# EasyEDA Pro project psu-5v-v101.eprj, board base-board
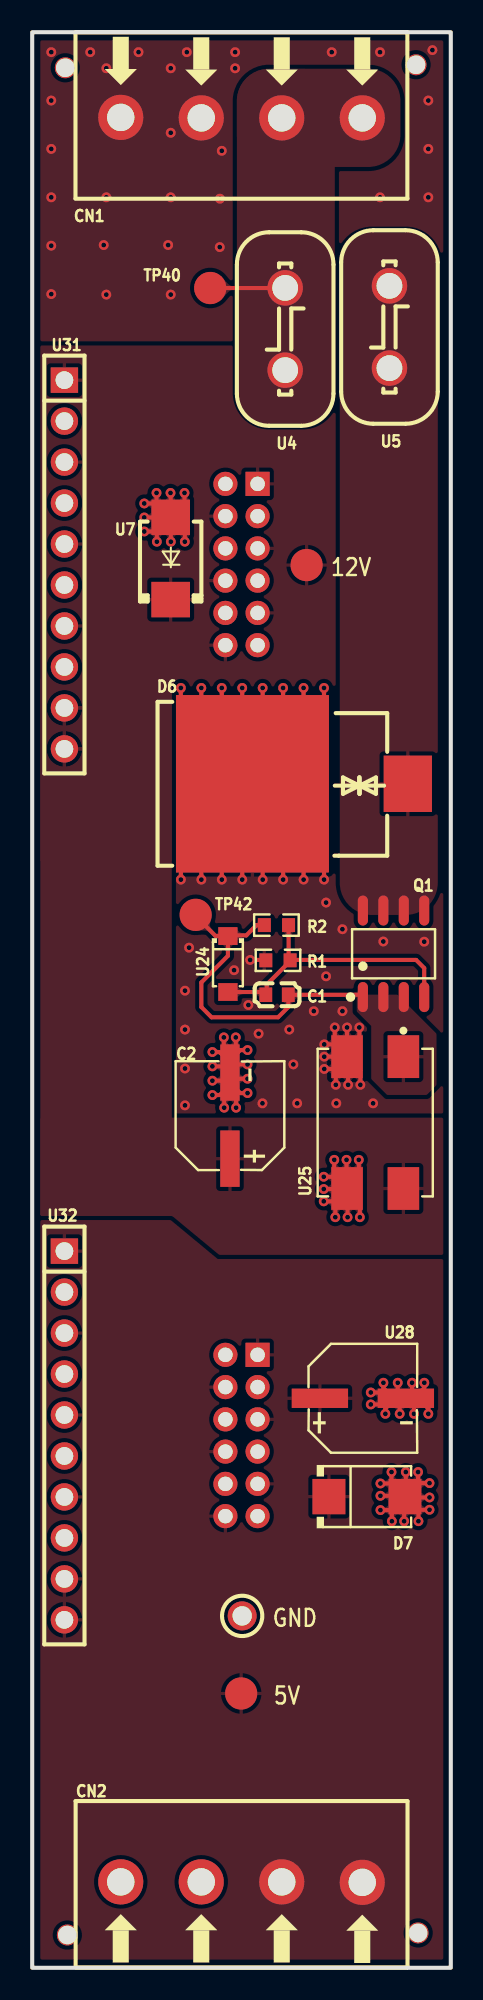
[diagram p5: board, top side]
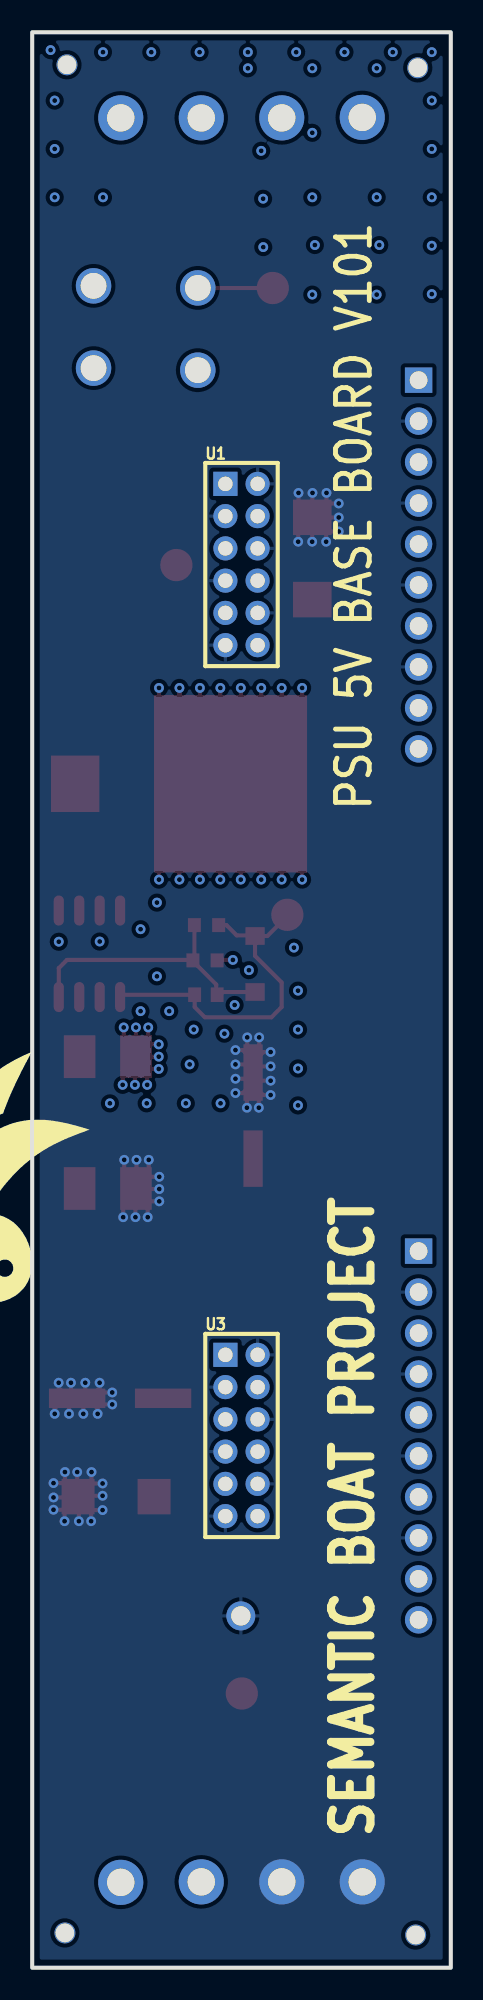
[diagram p6: board, bottom side, seen from below]

Outline 26 x 120 mm; copper layers: Top Layer, Inner1, Inner2, Bottom Layer. Coordinates in mm from the lower left corner of the outline.
Outline path: rectangle 0,120 26,0
Stack: Top Layer 0.07mm Outer layer thickness 1oz / Dielectric1 0.2104mm 7628 RC49% 8.6mil / Inner1 0.0152mm Inner layer thickness / Dielectric2 1.065mm 1.1mm H/HOZ Copper / Inner2 0.0152mm Inner layer thickness / Dielectric3 0.2104mm 7628 RC49% 8.6mil / Bottom Layer 0.07mm Outer layer thickness 1oz

## Design rules (mm)
template: Custom Config
spacing copperThickness1oz: track to track 0.102, other pairs 0.152 to 0.3
spacing copperThickness2oz (default): track to track 0.203, other pairs 0.152 to 0.3
spacing copperThicknessInner0.5oz: track to track 0.089, other pairs 0.152 to 0.3
track width copperThickness1oz: min 0.102, default 0.254, max 2.54
track width copperThickness2oz (default): min 0.203, default 0.254, max 2.54
track width copperThickness0.5oz: min 0.089, default 0.254, max 2.54
differential pair differentialPair (default): width min 0.127, default 0.254, max 2.54; gap min 0.152, default 0.152
via viaSize (default): diameter min 0.3, default 0.61, max 10; hole min 0.2, default 0.305, max 6.3

## Placement (name value [footprint] x y rotation side)
C1  100nF  [C0603]  15.21 60.33 180 top
C2  100uF  [CAP-SMD_BD6.3-L6.6-W6.6-LS7.6-RD]  12.28 52.83 90 top
CN1  WJ128V-5.0-4P  [CONN-TH_4P-P5.00_WJ128V-4P-5.0-14-00A]  13 114.71 180 top
CN2  WJ128V-5.0-4P  [CONN-TH_4P-P5.00_WJ128V-4P-5.0-14-00A]  13 5.31 0 top
D6  SM8S20CA  [DO-218AB_L13.5-W8.4-LS15.5-BI]  18.5 73.41 0 top
D7  SMBJ5.0A  [SMB_L4.6-W3.6-LS5.3-RD]  20.79 29.21 0 top
NOREF  -  [Pad_e17]  2.06 117.8 270 top
NOREF#2  -  [Pad_e14]  2.18 2.03 0 top
NOREF#3  -  [Pad_e16]  23.97 2.16 90 top
NOREF#4  -  [Pad_e19]  23.84 117.98 180 top
Q1  IRF7240TRPBF-JSM  [SOIC-8_L4.9-W4.0-P1.27-LS6.0-BL]  22.44 62.86 0 top
R1  47kΩ  [R0603]  15.27 62.46 0 top
R2  100kΩ  [R0603]  15.17 64.64 180 top
TP8  RH-5004  [TESTPOINT_TH_BD2.5-D1.2]  13.04 21.81 0 top
TP38  -  [Test-Point-0.5mm]  17.04 86.97 0 top
TP39  -  [Test-Point-0.5mm]  12.98 17 0 top
TP40  -  [Test-Point-0.5mm]  11.06 104.14 0 top
TP42  -  [Test-Point-0.5mm]  10.15 65.28 0 top
U1  2005FV-2x6P  [HDR-TH_12P-P2.00-V-F-R2-C6-S2.00]  13 87 270 bottom
U3  2005FV-2x6P  [HDR-TH_12P-P2.00-V-F-R2-C6-S2.00]  13 33 270 bottom
U4  G630-09-3T  [CONN-TH_2P-L8.2-W0.8-P5.10]  15.71 101.6 270 top
U5  G630-09-3T  [CONN-TH_2P-L8.2-W0.8-P5.10]  22.19 101.73 90 top
U7  SMBJ18A  [SMB_L4.5-W3.6-LS5.4-RD]  8.6 87.38 90 top
U24  BZT52C15  [SOD-123_L2.7-W1.6-LS3.8-RD]  12.16 62.23 270 top
U25  ACM9070-701-2PL-TL01  [FILTER-SMD_4P-L9.0-W7.0-TL]  21.31 52.4 270 top
U28  330uF  [CAP-SMD_BD6.3-L6.6-W6.6-LS7.4-FD]  20.54 35.31 0 top
U31  PM254-1-10-Z-8.5  [HDR-TH_10P-P2.54-V-F]  2 87 270 top
U32  PM254-1-10-Z-8.5  [HDR-TH_10P-P2.54-V-F]  2 33 270 top

## Footprints (pads in the part's own frame, mm; a bottom-side part is the same pattern mirrored in y, then rotated)
C0603
  rect 0.8x0.9 smd: 1(-0.7,0) 2(0.7,0)
CAP-SMD_BD6.3-L6.6-W6.6-LS7.4-FD
  rect 3.5x1.2 smd: 1(-2.67,0) 2(2.67,0)
CAP-SMD_BD6.3-L6.6-W6.6-LS7.6-RD
  rect 3.5x1.2 smd: 1(-2.67,0) 2(2.67,0)
CONN-TH_2P-L8.2-W0.8-P5.10
  round 2.2 hole 1.6: 1(-2.55,0) 2(2.55,0)
CONN-TH_4P-P5.00_WJ128V-4P-5.0-14-00A
  round 2.8 hole 1.7: 1(-7.5,0.015) 2(-2.5,0.015) 3(2.5,0.015) 4(7.5,-0.015)
DO-218AB_L13.5-W8.4-LS15.5-BI
  rect 9.5x11 smd: 1(-4.825,0)
  rect 3x3.5 smd: 2(4.825,0)
FILTER-SMD_4P-L9.0-W7.0-TL
  rect 2.65x1.96 smd: 1(-4.088,1.75) 2(-4.088,-1.75) 3(4.088,-1.75) 4(4.088,1.75)
HDR-TH_10P-P2.54-V-F
  rect 1.575x1.7 hole 1.1: 1(-11.43,0)
  round 1.7 hole 1.1: 2(-8.89,0) 3(-6.35,0) 4(-3.81,0) 5(-1.27,0) 6(1.27,0) 7(3.81,0) 8(6.35,0) 9(8.89,0) 10(11.43,0)
HDR-TH_12P-P2.00-V-F-R2-C6-S2.00
  rect 1.5x1.5 hole 0.9: 1(-5,-1)
  round 1.5 hole 0.9: 2(-5,1) 3(-3,-1) 4(-3,1) 5(-1,-1) 6(-1,1) 7(1,-1) 8(1,1) 9(3,-1) 10(3,1) 11(5,-1) 12(5,1)
Pad_e14
  round 1.3 hole 1.152: 1(0,0)
Pad_e16
  round 1.3 hole 1.152: 1(0,0)
Pad_e17
  round 1.3 hole 1.152: 1(0,0)
Pad_e19
  round 1.3 hole 1.152: 1(0,0)
R0603
  rect 0.806x0.864 smd: 1(-0.753,0) 2(0.753,0)
SMB_L4.5-W3.6-LS5.4-RD
  rect 2.2x2.4 smd: 1(-2.551,0) 2(2.551,0)
SMB_L4.6-W3.6-LS5.3-RD
  rect 2.047x2.192 smd: 1(-2.361,0) 2(2.361,0)
SOD-123_L2.7-W1.6-LS3.8-RD
  rect 1.1x1.2 smd: 1(-1.735,0) 2(1.735,0)
SOIC-8_L4.9-W4.0-P1.27-LS6.0-BL
  oval 0.63x1.865 smd: 1(-1.905,-2.683) 2(-0.635,-2.683) 3(0.635,-2.683) 4(1.905,-2.683) 5(1.905,2.683) 6(0.635,2.683) 7(-0.635,2.683) 8(-1.905,2.683)
Test-Point-0.5mm
  round 2 smd: 1(0,0)
TESTPOINT_TH_BD2.5-D1.2
  round 1.8 hole 1.2: 1(0,0)

## Nets
As in the schematic.

Pads without a net: NOREF 1; NOREF#2 1; NOREF#3 1; NOREF#4 1

## Via types
v1: diameter 0.61, hole 0.305, Top Layer to Bottom Layer, 130 vias

## Routing (per net, layer and track width the routed paths; a pad name or vN(x,y) marks a point on that pad's centre or on a via; arc(x,y) is an arc through that point)
GND: length 60.8
  Top Layer w0.254: v1(21.03,35.67) 22.09,35.67 21.81,35.94 v1(21.81,36.27) ; 12.77,55.99 12.79,56.01 v1(13.38,56.01) ; v1(22.7,36.27) 22.7,35.81 U28.2 ; v1(20.35,46.53) 20.35,47.52 19.59,48.28 v1(19.59,46.53) ; v1(7.74,88.41) 7.74,89.03 7.72,89.05 v1(6.96,89.05) ; v1(12.66,53.32) 12.66,54.48 12.92,54.23 v1(13.38,54.23) ; v1(21.03,34.93) 22.19,34.93 21.94,34.67 v1(21.94,34.34) ; v1(23.21,30.73) 23.21,29.26 D7.2 ; v1(21.63,29.26) 23.1,29.26 D7.2 ; v1(18.76,50.09) 18.76,49.4 ; 18.76,49.4 18.76,49.11 18.83,49.04 ; 18.76,49.4 19.52,48.64 v1(19.52,50.09) ; v1(22.32,30.73) 22.32,30.05 22.34,30.02 v1(21.63,30.02) ; U28.2 23.71,34.8 v1(23.71,34.34) ; U28.2 23.71,35.31 ; U28.2 22.82,34.92 v1(22.82,34.34) ; U28.2 23.59,35.69 v1(23.59,36.27) ; D7.2 23.21,29.16 v1(24.68,29.16) ; D7.2 23.1,29.16 ; v1(11.19,55.89) 11.9,55.89 C2.2 11.78,55 v1(11.19,55) ; v1(9.48,88.41) 9.48,89.05 8.61,89.92 ; v1(7.72,91.44) 7.72,90.81 7.74,90.79 v1(6.96,90.79) ; v1(6.96,89.92) 8.59,89.92 ; v1(18.83,46.53) 18.83,47.12 ; 23.71,35.31 24.35,35.94 24.35,36.26 v1(24.35,36.27) ; 23.71,35.31 23.97,35.31 24.6,34.67 v1(24.6,34.34) ; v1(13.38,55.12) 12.67,55.12 12.66,55.12 ; 8.61,89.92 U7.2 ; 8.61,89.92 v1(8.61,88.41) ; U7.2 8.6,91.43 v1(8.59,91.44) ; U7.2 9.46,90.79 v1(9.46,91.44) ; v1(20.28,50.09) 20.28,49.04 U25.3 18.83,49.04 ; v1(18.11,49.04) 18.83,49.04 ; v1(21.63,28.37) 22.32,28.37 22.34,28.4 ; v1(24.68,28.4) 23.97,28.4 23.99,28.37 v1(23.99,27.69) ; v1(13.38,56.9) 12.92,56.9 12.77,56.75 12.64,56.88 v1(12.64,57.68) ; 22.34,28.4 23.1,29.16 ; 22.34,28.4 v1(22.34,27.69) ; 23.1,29.16 v1(23.1,27.69) ; v1(23.97,30.73) 23.97,30.02 23.99,30.05 v1(24.68,30.05) ; v1(11.19,54.11) 11.65,54.11 11.92,54.38 v1(11.92,53.32) ; v1(11.9,57.68) 11.9,56.77 11.78,56.64 11.65,56.77 11.2,56.77 v1(11.19,56.78) ; 18.83,47.58 18.76,47.52 v1(18.11,47.52) ; v1(18.11,48.28) 19.52,48.28
GND_IN: length 84.2
  Top Layer w0.254: 13.05,72.77 D6.1 ; 13.05,72.77 v1(13.05,67.46) ; 13.05,72.77 11.78,71.5 ; v1(9.23,79.35) 9.23,77.85 10.5,76.58 v1(10.5,79.35) ; v1(19.56,58.3) 19.56,56.74 ; 19.56,56.74 18.79,57.5 ; 19.56,56.74 U25.2 ; U25.2 20.32,57.25 v1(20.32,58.3) ; U25.2 v1(18.14,56.49) ; v1(14.31,79.35) 14.31,74.04 ; v1(16.86,67.46) 16.86,70.23 18.13,68.96 v1(18.13,67.46) ; v1(13.54,62.48) 14.42,62.48 ; v1(13.04,79.35) 13.04,74.04 11.77,75.31 v1(11.77,79.35) ; v1(18.12,79.35) 18.12,77.85 16.85,76.58 v1(16.85,79.35) ; 18.79,57.5 v1(18.79,58.3) ; 18.79,57.5 18.79,57.25 v1(18.14,57.25) ; v1(15.59,67.46) 15.59,71.5 14.32,72.77 v1(14.32,67.46) ; v1(18.14,55.72) 18.79,55.72 18.86,55.79 v1(18.86,54.74) ; v1(10.51,67.46) 10.51,70.23 ; 10.51,70.23 11.78,71.5 ; 10.51,70.23 9.24,68.96 v1(9.24,67.46) ; 11.78,71.5 v1(11.78,67.46) ; v1(15.58,79.35) 15.58,75.31 ; v1(19.62,54.74) 19.62,56.42 20.38,55.66 v1(20.38,54.74)
  vias: v1(1.18,118.77) v1(1.18,115.77) v1(1.18,112.77) v1(1.18,109.77) v1(1.18,106.77) v1(1.18,103.77) v1(3.6,118.77) v1(4.44,106.81) v1(4.6,117.77) v1(4.6,109.77) v1(4.6,103.73) v1(6.6,118.77) v1(8.44,106.81) v1(8.6,117.77) v1(8.6,113.77) v1(8.6,109.77) v1(8.6,103.73) v1(9.49,60.58) v1(9.49,58.17) v1(9.49,55.75) v1(9.49,53.47) v1(9.6,118.77) v1(9.74,63.25) v1(11.65,106.68) v1(11.66,109.68) v1(11.78,112.65) v1(12.54,61.85) v1(12.6,118.77) v1(12.6,117.77) v1(13.43,59.69) v1(14.06,57.91) v1(14.3,53.59) v1(15.6,118.77) v1(15.97,58.17) v1(16.22,56.01) v1(16.46,53.59) v1(17.49,59.31) v1(18.25,66.04) v1(18.25,61.47) v1(18.6,118.77) v1(18.89,53.59) v1(19.27,64.39) v1(19.27,59.31) v1(21.17,53.59) v1(21.6,118.77) v1(21.6,109.77) v1(21.81,63.63) v1(24.35,63.61) v1(24.6,115.77) v1(24.6,112.77) v1(24.6,109.77) v1(24.86,118.89)
$1N44887: length 4.7
  Top Layer w0.254: TP40.1 15.71,104.14 U4.1
$1N46667: length 17.8
  Top Layer w0.254: 15.92,62.48 15.92,62.31 14.57,60.96 14.57,60.39 C1.2 14.34,60.5 U24.2 ; 15.92,62.48 23.84,62.48 24.35,61.98 Q1.4 ; 15.92,62.48 R2.1
$1N46681: length 21.9
  Top Layer w0.254: U24.1 12.2,64.01 13.3,64.01 13.94,64.64 R2.2 ; U24.1 11.4,63.97 10.59,64.77 9.64,64.77 ; U24.1 12.16,62.74 10.51,61.09 10.51,59.56 11.14,58.93 15.27,58.93 15.91,59.56 C1.1 20.4,60.33 Q1.1

## Copper pours and planes (outline as drawn; the poured copper is in the pictures)
+5V on Top Layer: -0.54,-0.63 27.14,-0.63 27.02,43.94 11.52,43.94 8.6,46.36 -0.42,46.36
+12V on Top Layer: -1.43,100.58 29.05,100.58 29.05,68.58 -1.43,68.58
+12V on Top Layer: -0.86,79.95 8.67,79.95 8.67,46.61 -0.86,46.61
+12V on Top Layer: -0.86,41.15 -0.86,52.7 27.59,52.7 27.59,41.15
GND on Bottom Layer: -4.86,123.83 28.79,123.83 28.79,-2.79 -4.86,-2.79
GND on Inner1: -2.57,51.31 26.63,51.31 26.63,-2.29 -2.57,-2.29
GND on Inner2: -2.57,51.31 26.63,51.31 26.63,-2.29 -2.57,-2.29
GND_IN on Top Layer: -4.48,122.81 29.68,122.81 29.68,100.71 -4.48,100.71
GND_IN on Top Layer: 7.97,68.33 27.14,68.33 27.14,51.94 7.97,51.94
GND_IN on Inner1: -3.08,123.7 27.02,123.7 27.02,51.94 -3.08,51.94
GND_IN on Inner2: -3.08,123.7 27.02,123.7 27.02,51.94 -3.08,51.94
$1N44887 on Top Layer: 20.87,117.73 21.16,117.71 21.44,117.65 21.7,117.55 21.95,117.42 22.18,117.25 22.38,117.04 22.56,116.82 22.69,116.56 22.79,116.3 22.85,116.02 22.87,115.73 22.87,113.65 22.85,113.37 22.79,113.09 22.69,112.82 22.56,112.57 22.38,112.34 22.18,112.14 21.95,111.97 21.7,111.83 21.44,111.73 21.16,111.67 20.87,111.65 14.71,111.65 14.43,111.67 14.15,111.73 13.88,111.83 13.63,111.97 13.4,112.14 13.2,112.34 13.03,112.57 12.89,112.82 12.79,113.09 12.73,113.37 12.71,113.65 12.71,115.73 12.73,116.02 12.79,116.3 12.89,116.56 13.03,116.82 13.2,117.04 13.4,117.25 13.63,117.42 13.88,117.55 14.15,117.65 14.43,117.71 14.71,117.73
$1N44887 on Top Layer: 18.8,97.63 18.78,97.35 18.72,97.07 18.62,96.8 18.48,96.55 18.31,96.32 18.11,96.12 17.88,95.95 17.63,95.81 17.36,95.71 17.08,95.65 16.8,95.63 14.71,95.63 14.43,95.65 14.15,95.71 13.88,95.81 13.63,95.95 13.4,96.12 13.2,96.32 13.03,96.55 12.89,96.8 12.79,97.07 12.73,97.35 12.71,97.63 12.71,115.73 12.73,116.02 12.79,116.29 12.89,116.56 13.03,116.81 13.2,117.04 13.4,117.24 13.63,117.41 13.88,117.55 14.15,117.65 14.43,117.71 14.71,117.73 16.8,117.73 17.08,117.71 17.36,117.65 17.63,117.55 17.88,117.41 18.11,117.24 18.31,117.04 18.48,116.81 18.62,116.56 18.72,116.29 18.78,116.02 18.8,115.73
$1N45787 on Top Layer: 19.11,105.69 19.13,105.98 19.19,106.26 19.29,106.52 19.42,106.77 19.59,107 19.8,107.2 20.02,107.38 20.28,107.51 20.54,107.61 20.82,107.67 21.11,107.69 23.19,107.69 23.47,107.67 23.75,107.61 24.02,107.51 24.27,107.38 24.5,107.2 24.7,107 24.87,106.77 25.01,106.52 25.11,106.26 25.17,105.98 25.19,105.69 25.19,67.28 25.17,66.99 25.11,66.71 25.01,66.44 24.87,66.19 24.7,65.97 24.5,65.76 24.27,65.59 24.02,65.46 23.75,65.36 23.47,65.3 23.19,65.28 21.11,65.28 20.82,65.3 20.54,65.36 20.28,65.46 20.02,65.59 19.8,65.76 19.59,65.97 19.42,66.19 19.29,66.44 19.19,66.71 19.13,66.99 19.11,67.28
$1N46681 on Top Layer: 21.05,55.1 21.05,58.4 20.16,59.29 20.16,60.33 22.69,60.33 25.11,57.91 25.11,54.72 24.5,54.11 22.04,54.11

Small or netless copper shapes (teardrops, artwork), in the pictures only: 146 on Top Layer

## Text on the board
Bottom Silkscreen Layer: PSU 5V BASE BOARD V101 | SEMANTIC BOAT PROJECT
Top Silkscreen Layer: GND | 5V | 12V
